# Altium schematic sheet 230C_12V_PSU_TPS40200.SchDoc: Communications
size Tabloid; CompanyName: Vertex; Organization: Vertex Downhole Ltd.; Address1: 7004 5 St SE Unit C; Address2: Calgary, AB; Address3: T2H 2G3; Address4: Canada; DocumentNumber: 550014; Revision: 4.1; SheetNumber: 6; SheetTotal: 8; Operating Temperature Range: -55°C ~ 230°C
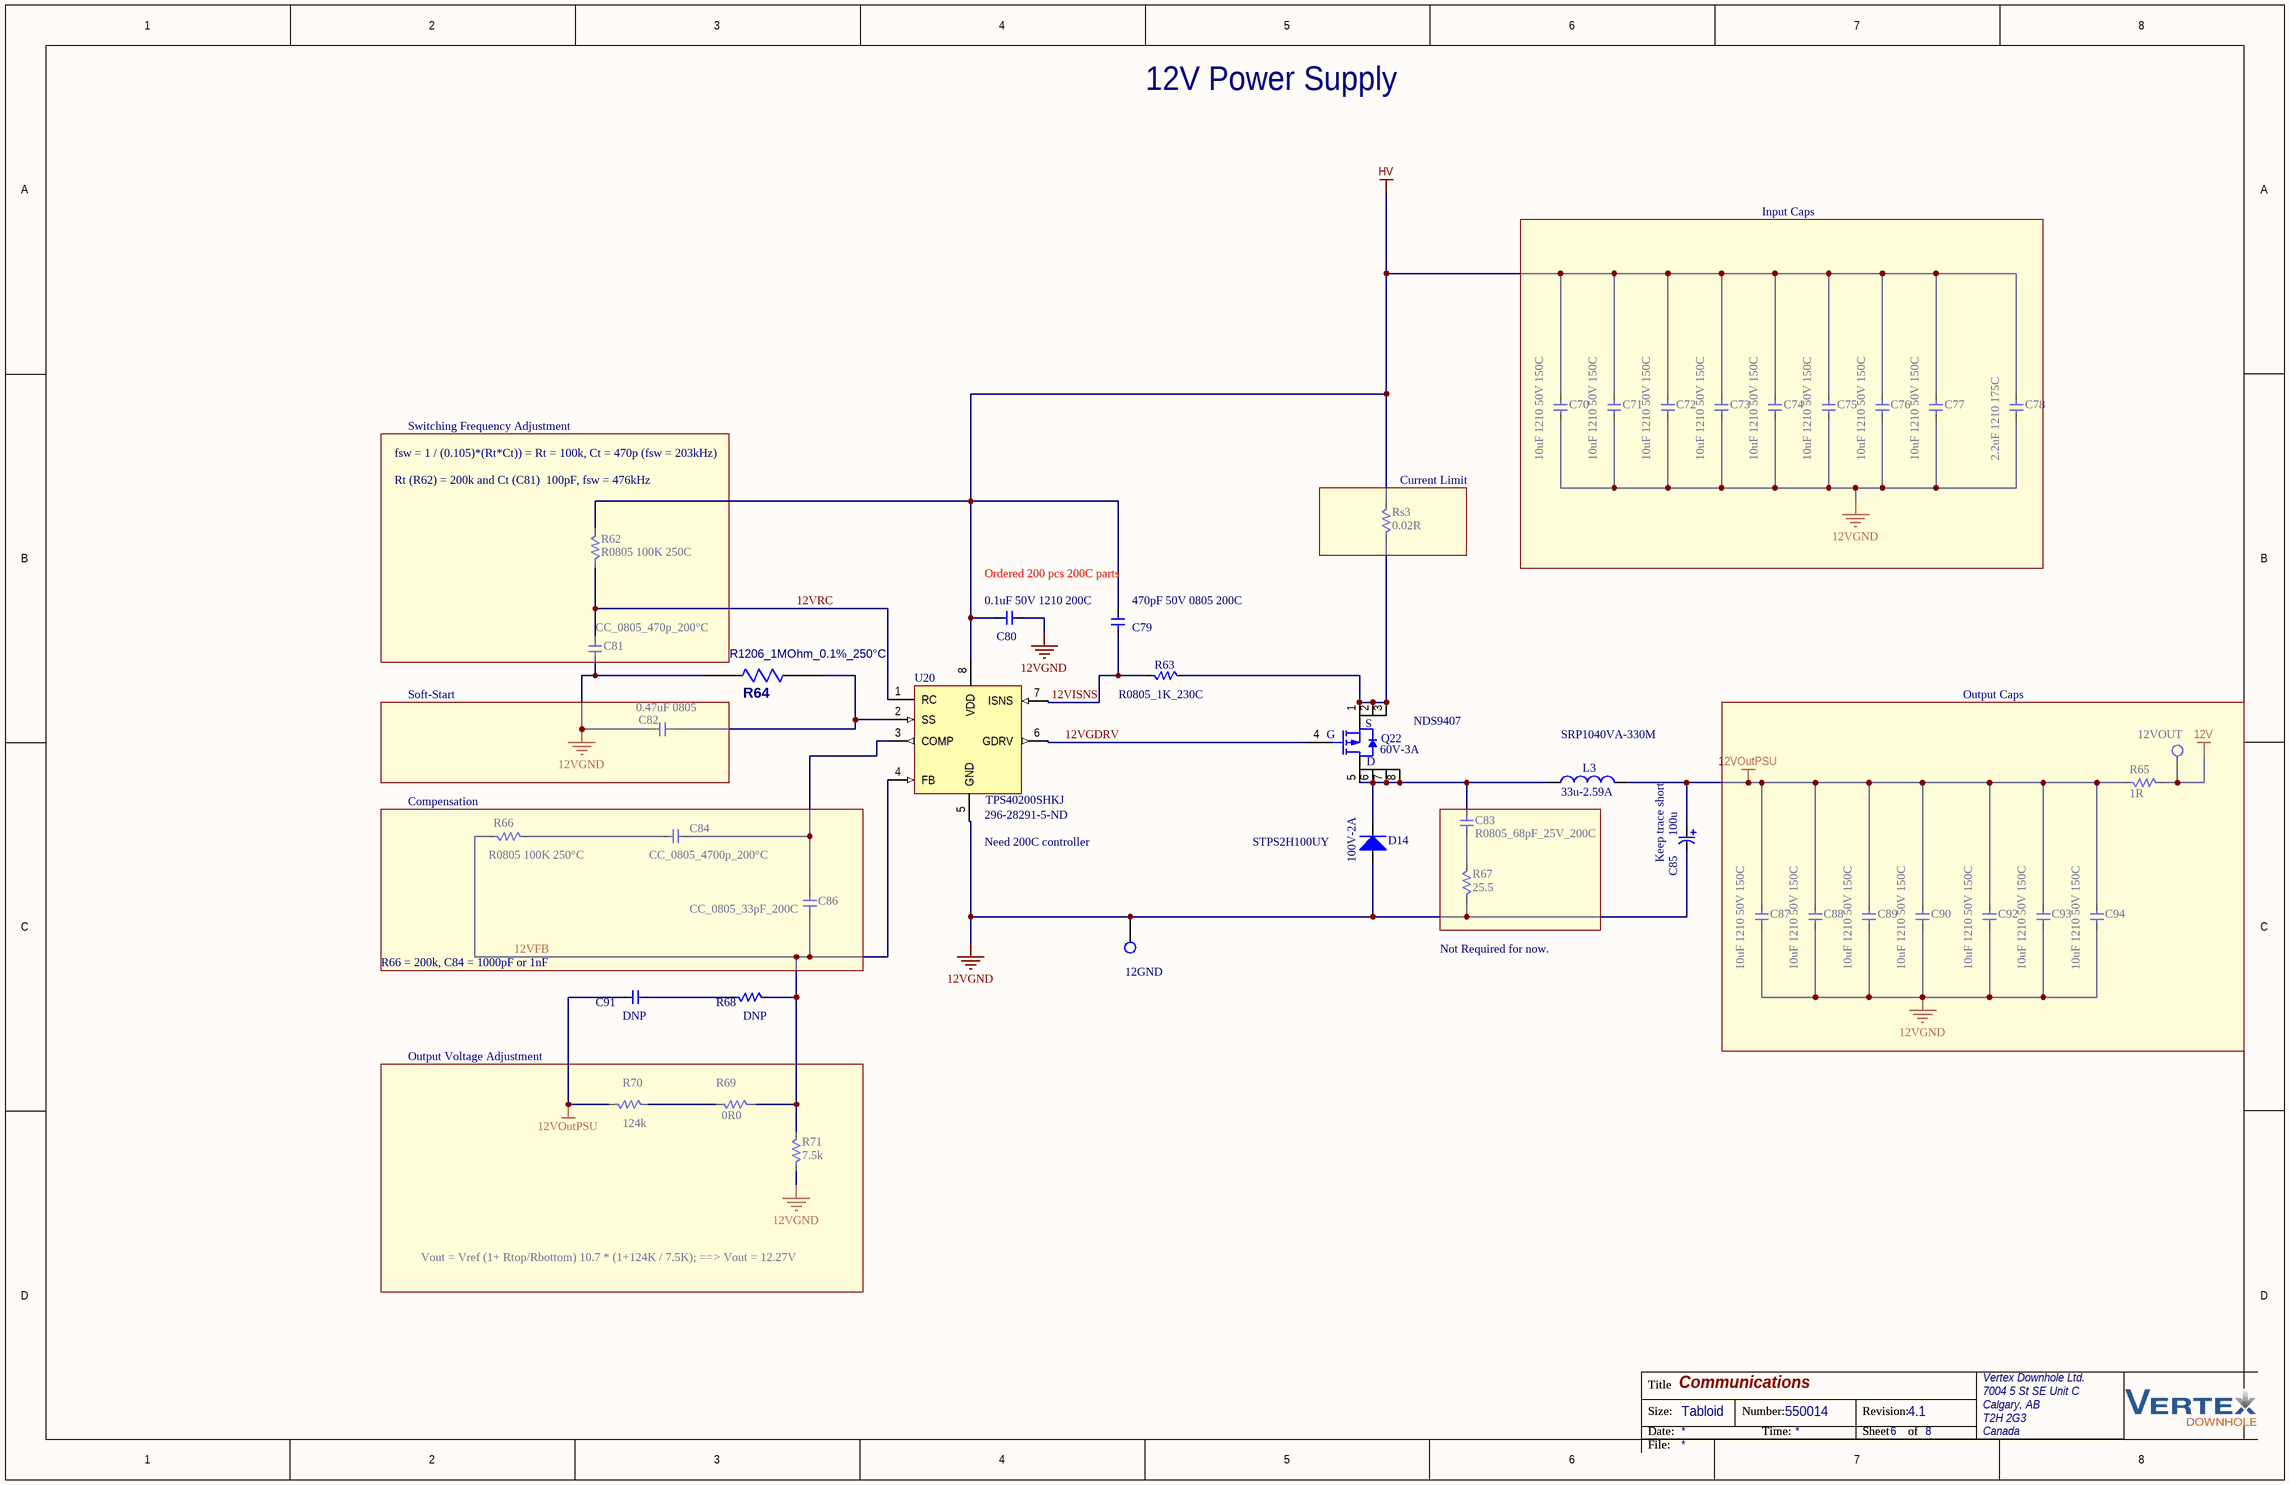
[diagram p0: 230C_12V_PSU_TPS40200.SchDoc]

## Parts
5  12VOUT  [TP-S]  (no BOM)
6  12GND  [TP-S]  (no BOM)
C70  value 10uF 1210 50V 150C  [1210]  (hidden comment: GCM32EL8EH106KA07K)
C71  value 10uF 1210 50V 150C  [1210]  (hidden comment: GCM32EL8EH106KA07K)
C72  value 10uF 1210 50V 150C  [1210]  (hidden comment: GCM32EL8EH106KA07K)
C73  value 10uF 1210 50V 150C  [1210]  (hidden comment: GCM32EL8EH106KA07K)
C74  value 10uF 1210 50V 150C  [1210]  (hidden comment: GCM32EL8EH106KA07K)
C75  value 10uF 1210 50V 150C  [1210]  (hidden comment: GCM32EL8EH106KA07K)
C76  value 10uF 1210 50V 150C  [1210]  (hidden comment: GCM32EL8EH106KA07K)
C77  value 10uF 1210 50V 150C  [1210]  (hidden comment: GCM32EL8EH106KA07K)
C78  value 2.2uF 1210 175C  [1210]  (hidden comment: C1206H104J3GACTU)
C79  value 470pF 50V 0805 200C  [1210]  (hidden comment: C1206H104J3GACTU)
C80  value 0.1uF 50V 1210 200C  [0805]  (hidden comment: 0805D121J251KHT)
C81  value CC_0805_470p_200°C  [0805]  (hidden comment: C0805H471J1GACTU)
C82  value 0.47uF 0805  [0805]  (hidden comment: C0805C272K5HACTU)
C83  value R0805_68pF_25V_200C  [0805]  (hidden comment: C0805H680J3GACTU)
C84  value CC_0805_4700p_200°C  [0805]  (hidden comment: C0805H472J1GACT500)
C85  value 100u  [0805]  (hidden comment: 0805D121J251KHT)
C86  value CC_0805_33pF_200C  [1210]  (hidden comment: C1206H104J3GACTU)
C87  value 10uF 1210 50V 150C  [1210]  (hidden comment: GCM32EL8EH106KA07K)
C88  value 10uF 1210 50V 150C  [1210]  (hidden comment: GCM32EL8EH106KA07K)
C89  value 10uF 1210 50V 150C  [1210]  (hidden comment: GCM32EL8EH106KA07K)
C90  value 10uF 1210 50V 150C  [1210]  (hidden comment: GCM32EL8EH106KA07K)
C91  C1206H104J3GACTU  [0603]  (value not drawn)
C92  value 10uF 1210 50V 150C  [1210]  (hidden comment: GCM32EL8EH106KA07K)
C93  value 10uF 1210 50V 150C  [1210]  (hidden comment: GCM32EL8EH106KA07K)
C94  value 10uF 1210 50V 150C  [1210]  (hidden comment: GCM32EL8EH106KA07K)
D14  value 100V-2A  [SMB]  (hidden comment: STPS2H100UY)
L3  value 33u-2.59A  [IND_CB_DRA125]  (hidden comment: DRA125-470-R)
Q22  value 60V-3A  [SOIC_S9407_ONS]  (hidden comment: NDS9407)
R62  value R0805 100K 250C  [0805]  (hidden comment: PATT0805E1003BGT1)
R63  value R0805_1K_230C  [0805]  (hidden comment: ERJ-PB6B6812V)
R64  R1206_1MOhm_0.1%_250°C  [1206]
R65  value 1R  [0805]  (hidden comment: RS73F2ATTD1501B)
R66  value R0805 100K 250°C  [0805]  (hidden comment: PATT0805E1003BGT1)
R67  value 25.5  [0805]  (hidden comment: ERJ-PB6B1004V)
R68  ERJ-PB6B6812V  [0805]  (value not drawn)
R69  value 0R0  [0805]  (hidden comment: PATT0603E49R9BGT1)
R70  value 124k  [0805]  (hidden comment: PATT0805E1003BGT1)
R71  value 7.5k  [0805]  (hidden comment: RNCP0805FTD1R00)
Rs3  value 0.02R  [1206]  (hidden comment: ERJ-8CWFR020V)
U20  Supplier Part Number 1: 296-28291-5-ND  [SOIC_S9407_ONS]  (hidden comment: TPS40200SHKJ)

## Blocks framed on the sheet
Input Caps: C70-C78
Current Limit: Rs3
Soft-Start: C82
Output Caps: 5 C87-C90 C92-C94 R65
Output Voltage Adjustment: R69-R71

## Nets
12V: 5.1 R65.2
12VGND: 6.1 C70.1 C71.1 C72.1 C73.1 C74.1 C75.1 C76.1 C77.1 C78.1 C80.2 C81.1 C82.1 C85.2 C87.1 C88.1 C89.1 C90.1 C92.1 C93.1 C94.1 D14.A R64.1(A) R67.1 R71.1 U20.5(GND)
12VOutPSU: C85.1 C87.2 C88.2 C89.2 C90.2 C91.1 C92.2 C93.2 C94.2 L3.2 R65.1 R70.1
HV: C70.2 C71.2 C72.2 C73.2 C74.2 C75.2 C76.2 C77.2 C78.2 C79.1 C80.1 R62.2 Rs3.2 U20.8(VDD)
12VFB: C86.1 R66.1 R68.2 R69.1 R71.2 U20.4(FB)
12VGDRV: Q22.4(G) U20.6(GDRV)
12VISNS: C79.2 R63.1 U20.7(ISNS)
12VRC: C81.2 R62.1 U20.1(RC)
NetC82_2: C82.2 R64.2(B) U20.2(SS)
NetC83_1: C83.1 R67.2
NetC83_2: C83.2 D14.K L3.1 Q22.5(D) Q22.6(D) Q22.7(D) Q22.8(D)
NetC84_1: C84.1 R66.2
NetC84_2: C84.2 C86.2 U20.3(COMP)
NetC91_2: C91.2 R68.1
NetQ22_1: Q22.1(S) Q22.2(S) Q22.3(S) R63.2 Rs3.1
NetR69_2: R69.2 R70.2

## Notes on the sheet
- 12V Power Supply
- Switching Frequency Adjustment
- fsw = 1 / (0.105)*(Rt*Ct)) = Rt = 100k, Ct = 470p (fsw = 203kHz)
- (near R62) Rt (R62) = 200k and Ct (C81)  100pF, fsw = 476kHz
- Ordered 200 pcs 200C parts
- (near Q22) NDS9407
- (near L3) SRP1040VA-330M
- (near R66) Compensation
- (near U20) Need 200C controller
- STPS2H100UY
- (near C85) Keep trace short
- R66 = 200k, C84 = 1000pF or 1nF
- (near R67) Not Required for now.
- (near C91) DNP
- (near R68) DNP
- Vout = Vref (1+ Rtop/Rbottom) 10.7 * (1+124K / 7.5K); ==> Vout = 12.27V
- Title
- Size:
- Date:
- Tabloid
- Number:
- Time:
- Revision:
- Sheet
- of
- File:

## Library data of the parts
5 6 = TP: Test  Point; Number: PMT104887; Subtype: Test Loop; Num Connections: 1; RoHS: 0; Package: Through hole
C70 C87 = CC-1210: CAP CER 0.1UF 50V C0G/NP0 1210 200C; Tolerance: ±10%; Temp. Coeff.: X8L; Mfg: Murata Electronics; Vendor: Digi-Key; VendorPN: 490-GCM32EL8EH106KA07KCT-ND; Do not load: 0; Class: Epart; CES#: *; Voltage: 50V; Temperature: -55°C ~ 150°C; Height: 1.6mm; MfgPN: GCM32EL8EH106KA07K; Unit Price: 19.5; Notes: *; Package: CC-1210; Dimension: 3.20mm x 1.60mm; #1Mfg: *; #1MfgPN: *; Temperature Tested: *
C71-C77 C88-C90 C92-C94 = CC-1210: CAP CER 0.1UF 50V C0G/NP0 1210 200C; Tolerance: ±5%; Temp. Coeff.: X8L; Mfg: Murata Electronics; Vendor: Digi-Key; VendorPN: 490-GCM32EL8EH106KA07KCT-ND; Do not load: 0; Class: Epart; CES#: *; Voltage: 50V; Temperature: -55°C ~ 200°C; Height: 1.6mm; MfgPN: GCM32EL8EH106KA07K; Unit Price: 19.5; Notes: *; Package: CC-1210; Dimension: 3.20mm x 1.60mm; #1Mfg: *; #1MfgPN: *; Temperature Tested: *
C78 = CC-1210: CAP CER 0.1UF 50V C0G/NP0 1210 200C; Voltage: 25V; Tolerance: ±5%; Temp. Coeff.: C0G, NP0; Mfg: KEMET; Vendor: Digi-Key; VendorPN: 399-5750; Do not load: 0; Class: Epart; CES#: *; Temperature: -55°C ~ 200°C; Height: 1.6mm; MfgPN: C1206H104J3GACTU; Unit Price: 19.5; Notes: *; Package: CC-1206; Dimension: 3.20mm x 1.60mm; #1Mfg: *; #1MfgPN: *; Temperature Tested: *
C79 = CC-0805-100p-100V-10%-200C-NP0: CAP CER 470PF 50V C0G/NP0 0805 200C; Voltage: 100V; Tolerance: ±5%; Temp. Coeff.: C0G, NP0; Mfg: Vishay Vitramont; MfgPN: VJ0805D471JXAQJHT; Vendor: Digi-Key; VendorPN: 720-VJ0805D471JXAQJHTCT-ND; Do not load: 0; Class: Epart; Temperature: VJ0805D471JXAQJHT; Height: 1.37mm; Unit Price: 0.34; Notes: *; Package: CC-0805; Dimension: 1.60mm x 0.80mm; #1Mfg: *; #1MfgPN: *; Temperature Tested: *
C80 = CC-1210: CAP CER 0.1UF 50V C0G/NP0 1210 200C; Voltage: 25V; Tolerance: ±5%; Temp. Coeff.: C0G, NP0; Mfg: KEMET; MfgPN: C1206H104J3GACTU; Vendor: Digi-Key; VendorPN: 399-5750; Do not load: 0; Class: Epart; CES#: *; Temperature: -55°C ~ 200°C; Height: 1.6mm; Unit Price: 19.5; Notes: *; Package: CC-1206; Dimension: 3.20mm x 1.60mm; #1Mfg: *; #1MfgPN: *; Temperature Tested: *
C81 = CC-0805-470p-100V-10%-150C-NP0: CAPACITOR CER 470PF 100V C0G/NP0 0805; Tolerance: ±10%; Temp. Coeff.: C0G, NP0; Mfg: KEMET; Vendor: Digi-Key; VendorPN: 720-1262; Do not load: 0; Class: Epart; CES#: *; Voltage: 100V; Temperature: -55°C ~ 200°C; Height: 1.25mm; MfgPN: C0805H471J1GACTU; Unit Price: 0.47; Notes: *; Package: CC-0805; Dimension: 2.00mm x 1.25mm; #1Mfg: *; #1MfgPN: *; Temperature Tested: *
C82 = CC-0805-47n-25V-5%-125C-NP0: CAPACITOR CER 0.047UF 25V C0G/NP0 0805; Tolerance: ±5%; Temp. Coeff.: C0G, NP0; Mfg: KEMET; MfgPN: C0805C473J3GACAUTO; Vendor: Digi-Key; VendorPN: 399-6970; Do not load: 0; Class: Epart; CES#: *; Voltage: 25V; Temperature: -55°C ~ 125°C; Height: 1.25mm; Unit Price: 0.95; Notes: *; Package: CC-0805; Dimension: 2.00mm x 1.25mm; #1Mfg: *; #1MfgPN: *; Temperature Tested: *
C83 = CC-0805-2200p-100V-5%-200C-NP0: CAPACITOR CER 2200PF 100V C0G/NP0 0805; Tolerance: ±5%; Temp. Coeff.: C0G, NP0; Mfg: KEMET; Vendor: Mouser; VendorPN: 80-C0805H680J3G; Do not load: 0; Class: Epart; Voltage: 100V; Temperature: -55°C ~ 200°C; Height: 0.9mm; MfgPN: C0805H680J3GACTU; Unit Price: 2.65; Notes: *; Package: CC-0805; Dimension: 2.00mm x 1.25mm; #1Mfg: *; #1MfgPN: *; Temperature Tested: *; Supplier 1: Digi-Key
C84 = CC-0805-2200p-100V-5%-200C-NP0: CAPACITOR CER 2200PF 100V C0G/NP0 0805; Tolerance: ±5%; Temp. Coeff.: C0G, NP0; Mfg: KEMET; Vendor: Digi-Key; VendorPN: 399-9996-2-ND; Do not load: 0; Class: Epart; Voltage: 100V; Temperature: -55°C ~ 200°C; Height: 0.9mm; MfgPN: C0805H472J1GACT500; Unit Price: 2.65; Notes: *; Package: CC-0805; Dimension: 2.00mm x 1.25mm; #1Mfg: *; #1MfgPN: *; Temperature Tested: *; Supplier 1: Digi-Key
C85 = CT-2917-100u-16V-10%-150C: CAPACITOR TANT 100UF 16V 10% 2917; Mfg: KEMET; MfgPN: T498X107K016ATE075; Vendor: Digi-Key; VendorPN: 399-5207; Do not load: 0; Class: Epart; CES#: *; Voltage: 16V; Tolerance: ±10%; Temperature: -55°C ~ 150°C; Height: 4.1mm; Unit Price: 6.63; Notes: *; Package: CT-2917; Dimension: 7.30mm x 4.30mm; #1Mfg: *; #1MfgPN: *; Temperature Tested: *
C86 = CC-0805-120p-100V-5%-200C-NP0: CAPACITOR CER 120PF 250V NP0 0805; Tolerance: ±5%; Temp. Coeff.: C0G, NP0; Mfg: Knowles Novacap; MfgPN: 0805D121J251KHT; Vendor: Digi-Key; Do not load: 0; Class: Epart; Voltage: 250V; Temperature: -55°C ~ 200°C; Height: 1.37mm; VendorPN: 0805D121J251KHT; Unit Price: 0.25; Notes: *; Package: CC-0805; Dimension: 2.03mm x 1.27mm; #1Mfg: *; #1MfgPN: *; Temperature Tested: *
C91 = CC-0805-2700p-50V-10%-150C: CAPACITOR CER 2700PF 50V X8R 0805; Do not load: YES; Class: Epart; CES#: *; Height: 1.25mm; Unit Price: 0.84; Notes: *; Package: CC-0805; Dimension: 2.00mm x 1.25mm; #1Mfg: *; #1MfgPN: *; Temperature Tested: *
D14 = DS-SMB-100V-2A: DIODE SCHOTTKY 100V 2A SMB; Mfg: STMicroelectronics; Vendor: Digi-Key; VendorPN: 497-11093; Do not load: 0; Class: Epart; CES#: *; Temperature: -40°C ~ 175°C; Voltage: 100V; Height: 1.9 mm; MfgPN: STPS2H100UY; Unit Price: 0.81; Notes: *; Current: 2A; Package: SMB; Dimension: 3.5 X 2.8 X 1.9 mm; #1Mfg: *; #1MfgPN: *; Temperature Tested: *
L3 = LL-12.5X12.5-47u-2.59A: INDUCTOR 47UH 2.59A 81 MOHM; DC Resistance (DCR): 81 mOhm; Mfg: Eaton; Vendor: Digi-Key; VendorPN: 283-3577; Do not Load: 0; Tolerance: ±20%; Class: Epart; CES#: *; Temperature: -40°C ~ 165°C; Height: 6 mm; MfgPN: DRA125-470-R; Unit Price: 4.36; Current: 2.59A; Package: LL-12.5X12.5; Dimension: 12.50mm x 12.50mm; #2Mfg: *; #2MfgPN: *; Temperature Tested: *
Q22 = QF-SOIC8-PCH-60V-3A: MOSFET P-CH 60V 3A 8-SOIC; Mfg: ON Semiconductor; Vendor: Digi-Key; Do not Load: 0; Power: 2.5W (Ta); Rds On: 150 mOhm @ 3A, 10V; Class: Epart; Temperature: -55°C ~ 175°C (TJ); Voltage: 60V; Height: 1.7 mm; MfgPN: NDS9407; VendorPN: NDS9407; Unit price: 1.55; Package: SOIC8; Dimension: 6.2 X 5.0 X 1.7 mm; Current: 3A; #2Mfg: *; #2MfgPN: *; Temperature Tested: *
R62 R66 R70 = RS-0805-9.1K-0.1%-1/4W-155C: 100 kOhms ±0.1% 0.2W, 1/5W Chip Resistor 0805 (2012 Metric); Temp. Coeff.: ±25ppm/°C; Mfg: Vishay Dale Thin Film; Vendor: Digi-Key; VendorPN: 764-1065-1-ND; Do not load: 0; Power: 0.25W; Class: Epart; Tolerance: ±0.1%; Temperature: -55°C ~ 250°C; Height: 0.46 mm; MfgPN: PATT0805E1003BGT1; Unit Price: 0.55; Notes: *; Package: RS-0805; Dimension: 1.60mm x 0.80mm; #2Mfg: *; #2MfgPN: *; Temperature Tested: *
R63 = RS-0805-1K-0.1%-1/8W-155C: RESISTOR SMD 1K OHM 0.1% 1/8W 0805; Tolerance: ±1%; Temp. Coeff.: ±25ppm/°C; Mfg: Vishay / Sfernice; MfgPN: CHPHT0805K1001FGT; Vendor: Mouser; VendorPN: 71-CHPHT0805K1001FGT; Do not load: 0; Power: 0.125W; Class: Epart; CES#: *; Temperature: -55°C ~ 230°C; Height: 0.7 mm; Notes: *; Package: RS-0805; Dimension: 2.00mm x 1.25mm; #2Mfg: *; #2MfgPN: *; Temperature Tested: *
R64 = RC_1206: 1206; Part Field 1: Description Resistor in 1206 package; MPN: PATT1206E1004BGT1; Mfr: Vishay Dale Thin Film
R65 = RS-0805-1R-1%-0.25W-155C: RESISTOR SMD 1 OHM 1% 1/4W 0805; Temp. Coeff.: ±100ppm/°C; Mfg: Stackpole Electronics Inc.; MfgPN: RNCP0805FTD1R00; Vendor: Digi-Key; Do not load: 0; Power: 0.25W; Class: Epart; CES#: *; Tolerance: ±1%; Temperature: -55°C ~ 155°C; Height: 0.7 mm; VendorPN: RNCP0805FTD1R00; Unit Price: 0.15; Notes: *; Package: RS-0805; Dimension: 2.00mm x 1.25mm; #2Mfg: *; #2MfgPN: *; Temperature Tested: *
R67 = RS-0805-10.2K-0.1%-0.25W-155C: RESISTOR SMD 10.2K OHM 1% 1/4W 0805; Temp. Coeff.: ±50ppm/°C; Mfg: Panasonic Electronic Components; MfgPN: ERJ-PB6B1022V; Vendor: Digi-Key; VendorPN: P20709TR-ND; Do not load: 0; Power: 0.25W; Class: Epart; Tolerance: ±1%; Temperature: -55°C ~ 155°C; Height: 0.7 mm; Unit Price: 0.55; Notes: *; Package: RS-0805; Dimension: 2.00mm x 1.25mm; #2Mfg: *; #2MfgPN: *; Temperature Tested: *
R68 = RS-0805-475R-0.1%-0.25W-155C: RESISTOR SMD 475 OHM 0.1% 1/10W 0805; Do not load: YES; Class: Epart; Height: 0.7 mm; Notes: *; Package: RS-0805; Dimension: 2.00mm x 1.25mm; #2Mfg: *; #2MfgPN: *; Temperature Tested: *
R69 = RS-0805-1.5K-0.1%-1/4W-155C: 49.9 Ohms ±0.1% 0.15W Chip Resistor 0603 (1608 Metric) Anti-Sulfur, Automotive AEC-Q200, Moisture Resistant Thin Film; Temp. Coeff.: ±25ppm/°C; Mfg: Vishay Dale Thin Film; Vendor: Digi-Key; VendorPN: 764-1019-1-ND; Do not load: 0; Power: 0.250W; Class: Epart; CES#: *; Tolerance: ±0.1%; Temperature: -55°C ~ 255°C; Height: 0.46 mm; MfgPN: PATT0603E49R9BGT1; Notes: *; Package: RS-0805; Dimension: 2.00mm x 1.25mm; #2Mfg: *; #2MfgPN: *; Temperature Tested: *
R71 = RS-0805-49.9R-0.25%-0.25W-155C: RESISTOR SMD 49.9 OHM 0.1% 1/25W 0805; Temp. Coeff.: ±25ppm/°C; Mfg: KOA Speer Electronics, Inc.; MfgPN: RS73G2ATTD49R9C; Vendor: Digi-Key; VendorPN: 2019-RS73G2ATTD49R9CTR-ND; Do not load: 0; Power: 0.25W; Class: Epart; Tolerance: ±0.1%; Temperature: -55°C ~ 155°C; Height: 0.5 mm; Unit Price: 0.113; Notes: *; Package: RS-0603; Dimension: 1.60mm x 0.80mm; #2Mfg: *; #2MfgPN: *; Temperature Tested: *
Rs3 = RS-1206-0.02R-1%-1W-155C: RESISTOR SMD 0.02 OHM 1% 1W 1206; Temp. Coeff.: ±75ppm/°C; Mfg: Panasonic Electronic Components; Vendor: Digi-Key; VendorPN: P0.02BV; Do not load: 0; Class: Epart; CES#: *; Tolerance: ±1%; Temperature: -55°C ~ 155°C; Height: 0.6; MfgPN: ERJ-8CWFR020V; Unit Price: 1.04; Notes: *; Power: 1W; Package: RS-1206; Dimension: 1.60mm x 3.20mm; #2Mfg: *; #2MfgPN: *; Temperature Tested: *
U20 = UP-SREG-CFP8-Buck-ADJ-TPS40200: IC REG CTRLR BUCK 8CFP; Mfg: Texas Instruments; Vendor: Digi-Key; VendorPN: 296-28291; Do not load: 0; Voltage Output: Adjustive; Voltage Input: 5.5 V ~ 52 V; Class: Epart; Topology: Buck; Temperature: -55°C ~ 210°C (TA); Height: 2.0 mm; MfgPN: TPS40200SHKJ; Unit Price: 140.54; Notes: *; Package: CFP-8; Dimension: 24.7 X 7.3 X 2.0; #2Mfg: *; #2MfgPN: *; Temperature Tested: *; Value: TPS40200SHKJ; Supplier 1: Digi-Key